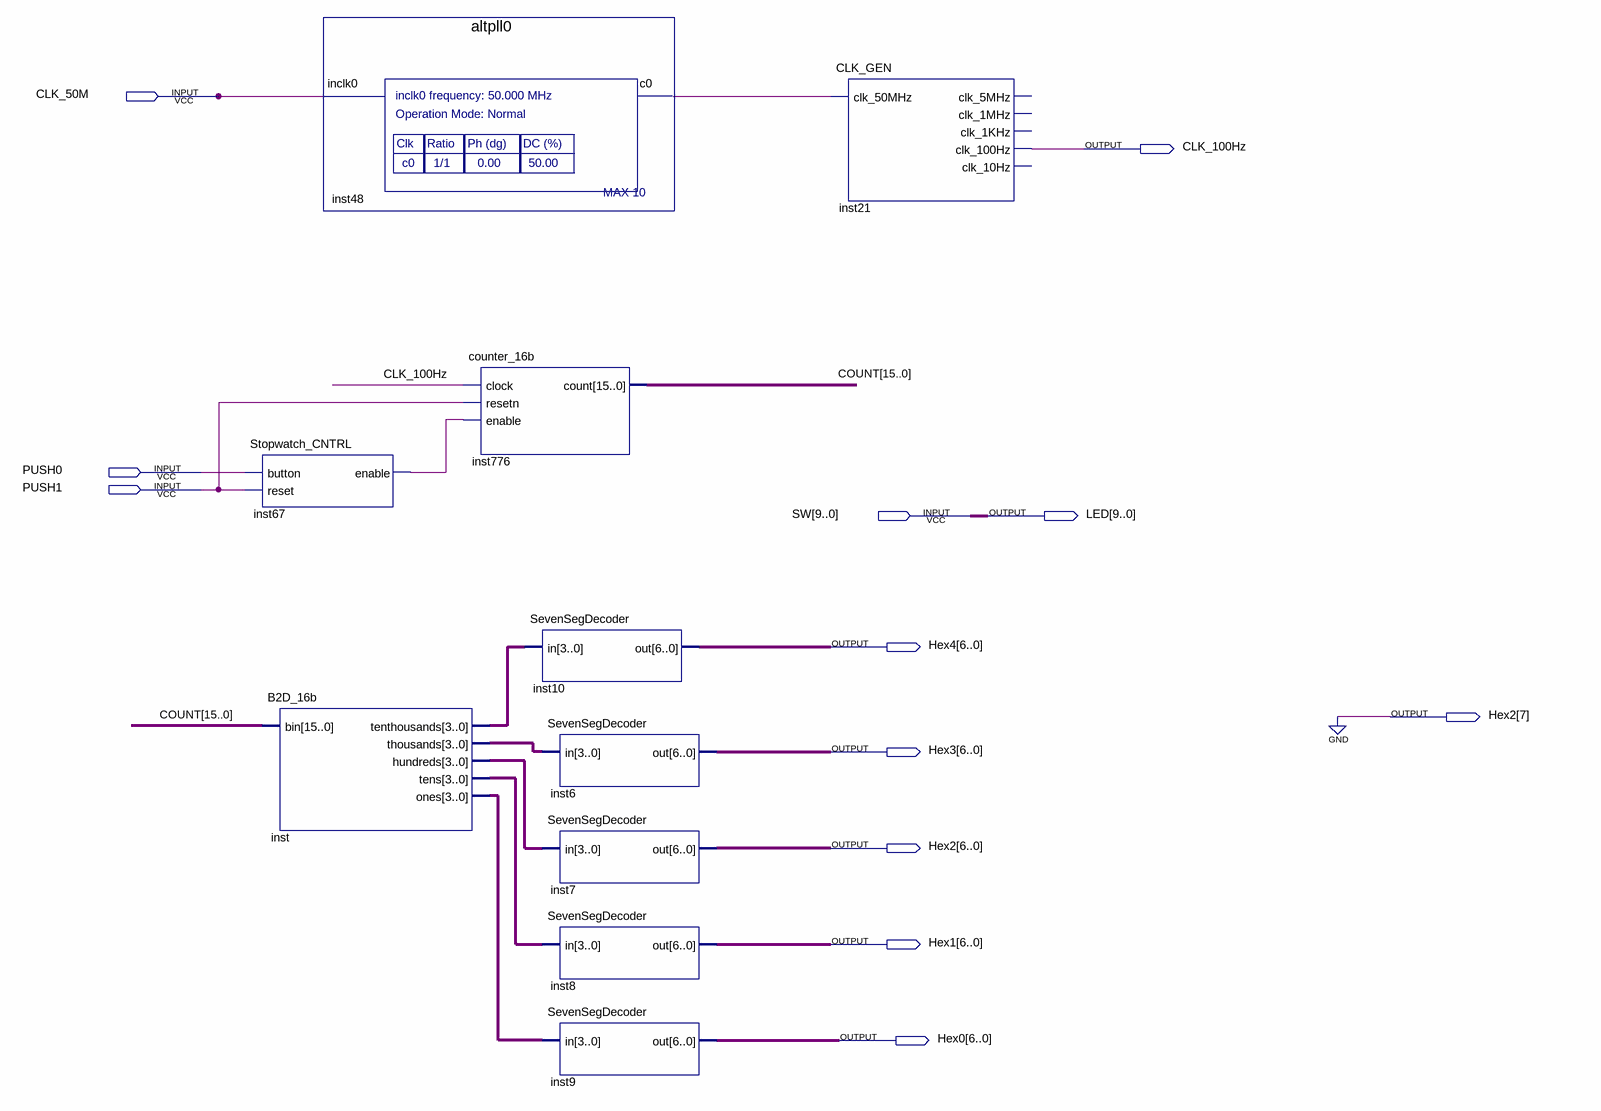
[diagram p0: schematic sheet]
// Quartus schematic Test_Project.bdf as structural Verilog: 10 symbols, 12 pins
module Test_Project (
  input  CLK_50M,
  input  PUSH0,
  input  PUSH1,
  input  [9:0] SW,
  output CLK_100Hz,
  output [9:0] LED,
  output [6:0] Hex4,
  output [7:0] Hex2,
  output [6:0] Hex3,
  output [6:0] Hex1,
  output [6:0] Hex0
);

  wire inst48_c0, inst67_enable;
  wire [3:0] inst_hundreds, inst_ones, inst_tens, inst_tenthousands, inst_thousands;
  wire [15:0] COUNT;

  Stopwatch_CNTRL inst67 (.button(PUSH0), .reset(PUSH1), .enable(inst67_enable));
  B2D_16b inst (
    .bin(COUNT), .tenthousands(inst_tenthousands), .thousands(inst_thousands), .hundreds(inst_hundreds),
    .tens(inst_tens), .ones(inst_ones));
  altpll0 inst48 (.inclk0(CLK_50M), .c0(inst48_c0));
  counter_16b inst776 (.clock(CLK_100Hz), .resetn(PUSH1), .enable(inst67_enable), .count(COUNT));
  SevenSegDecoder inst10 (.in(inst_tenthousands), .out(Hex4));
  SevenSegDecoder inst6 (.in(inst_thousands), .out(Hex3));
  SevenSegDecoder inst7 (.in(inst_hundreds), .out(Hex2[6:0]));
  SevenSegDecoder inst8 (.in(inst_tens), .out(Hex1));
  SevenSegDecoder inst9 (.in(inst_ones), .out(Hex0));
  CLK_GEN inst21 (.clk_50MHz(inst48_c0), .clk_100Hz(CLK_100Hz));  // open: clk_5MHz, clk_1MHz, clk_1KHz, clk_10Hz

  assign Hex2[7] = 1'b0;
  assign LED = SW;
endmodule
